# Altium schematic sheet 5) 64MB SDRAM.SchDoc
size 420 x 297 mm
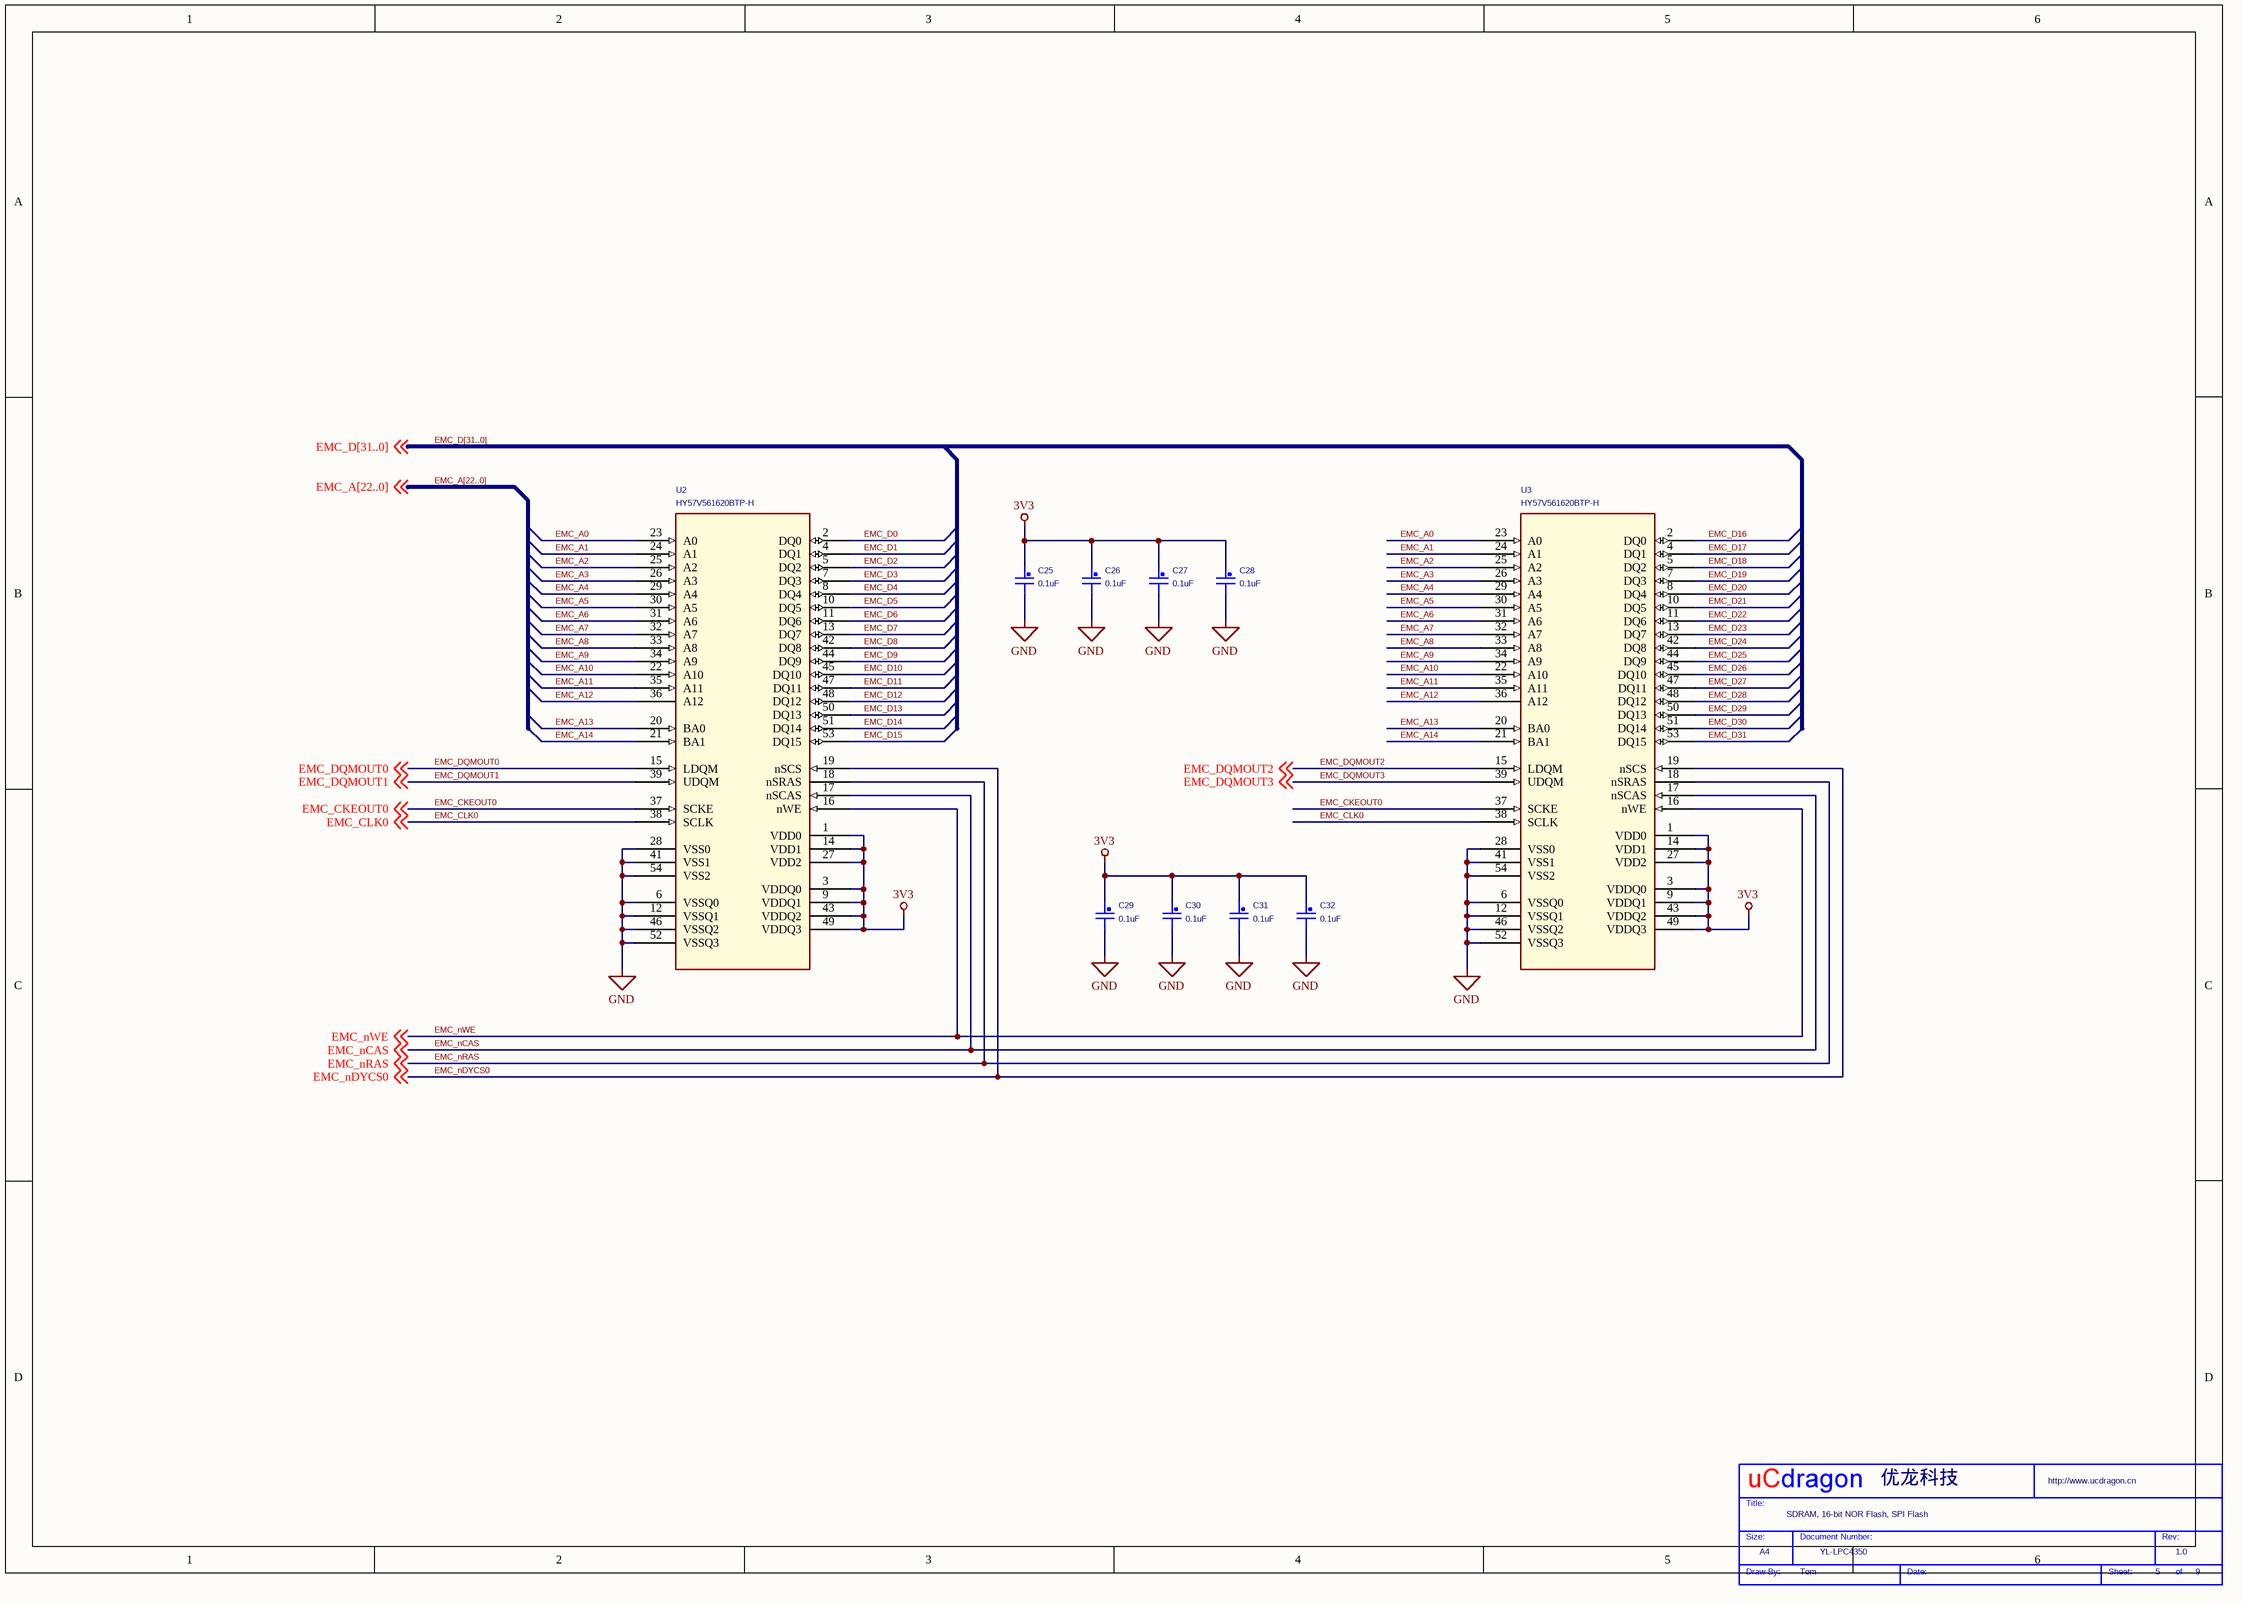
[diagram p0: 5) 64MB SDRAM.SchDoc]

## Parts
*  Company: 优龙科技  Drawing: Tom  Doc: YL-LPC4350  RevCode: 1.0  Title: SDRAM, 16-bit NOR Flash, SPI Flash  Page Size: A4  Page Number: 5  Page Count: 9  (hidden comment: My Title 0)  (graphical)
C25  0.1uF  [CAP0805]
C26  0.1uF  [CAP0805]
C27  0.1uF  [CAP0805]
C28  0.1uF  [CAP0805]
C29  0.1uF  [CAP0805]
C30  0.1uF  [CAP0805]
C31  0.1uF  [CAP0805]
C32  0.1uF  [CAP0805]
U2  HY57V561620BTP-H  [K4S561632E-TSOP54]
U3  HY57V561620BTP-H  [K4S561632E-TSOP54]

## Nets
3V3: C25.1 C26.1 C27.1 C28.1 C29.1 C30.1 C31.1 C32.1 U2.1(VDD0) U2.3(VDDQ0) U2.9(VDDQ1) U2.14(VDD1) U2.27(VDD2) U2.43(VDDQ2) U2.49(VDDQ3) U3.1(VDD0) U3.3(VDDQ0) U3.9(VDDQ1) U3.14(VDD1) U3.27(VDD2) U3.43(VDDQ2) U3.49(VDDQ3)
GND: C25.2 C26.2 C27.2 C28.2 C29.2 C30.2 C31.2 C32.2 U2.6(VSSQ0) U2.12(VSSQ1) U2.28(VSS0) U2.41(VSS1) U2.46(VSSQ2) U2.52(VSSQ3) U2.54(VSS2) U3.6(VSSQ0) U3.12(VSSQ1) U3.28(VSS0) U3.41(VSS1) U3.46(VSSQ2) U3.52(VSSQ3) U3.54(VSS2)
EMC_A0: U2.23(A0) U3.23(A0)
EMC_A1: U2.24(A1) U3.24(A1)
EMC_A2: U2.25(A2) U3.25(A2)
EMC_A3: U2.26(A3) U3.26(A3)
EMC_A4: U2.29(A4) U3.29(A4)
EMC_A5: U2.30(A5) U3.30(A5)
EMC_A6: U2.31(A6) U3.31(A6)
EMC_A7: U2.32(A7) U3.32(A7)
EMC_A8: U2.33(A8) U3.33(A8)
EMC_A9: U2.34(A9) U3.34(A9)
EMC_A10: U2.22(A10) U3.22(A10)
EMC_A11: U2.35(A11) U3.35(A11)
EMC_A12: U2.36(A12) U3.36(A12)
EMC_A13: U2.20(BA0) U3.20(BA0)
EMC_A14: U2.21(BA1) U3.21(BA1)
EMC_CKEOUT0: U2.37(SCKE) U3.37(SCKE) ; off-sheet EMC_CKEOUT0
EMC_CLK0: U2.38(SCLK) U3.38(SCLK) ; off-sheet EMC_CLK0
EMC_D0: U2.2(DQ0)
EMC_D1: U2.4(DQ1)
EMC_D2: U2.5(DQ2)
EMC_D3: U2.7(DQ3)
EMC_D4: U2.8(DQ4)
EMC_D5: U2.10(DQ5)
EMC_D6: U2.11(DQ6)
EMC_D7: U2.13(DQ7)
EMC_D8: U2.42(DQ8)
EMC_D9: U2.44(DQ9)
EMC_D10: U2.45(DQ10)
EMC_D11: U2.47(DQ11)
EMC_D12: U2.48(DQ12)
EMC_D13: U2.50(DQ13)
EMC_D14: U2.51(DQ14)
EMC_D15: U2.53(DQ15)
EMC_D16: U3.2(DQ0)
EMC_D17: U3.4(DQ1)
EMC_D18: U3.5(DQ2)
EMC_D19: U3.7(DQ3)
EMC_D20: U3.8(DQ4)
EMC_D21: U3.10(DQ5)
EMC_D22: U3.11(DQ6)
EMC_D23: U3.13(DQ7)
EMC_D24: U3.42(DQ8)
EMC_D25: U3.44(DQ9)
EMC_D26: U3.45(DQ10)
EMC_D27: U3.47(DQ11)
EMC_D28: U3.48(DQ12)
EMC_D29: U3.50(DQ13)
EMC_D30: U3.51(DQ14)
EMC_D31: U3.53(DQ15)
EMC_DQMOUT0: U2.15(LDQM) ; off-sheet EMC_DQMOUT0
EMC_DQMOUT1: U2.39(UDQM) ; off-sheet EMC_DQMOUT1
EMC_DQMOUT2: U3.15(LDQM) ; off-sheet EMC_DQMOUT2
EMC_DQMOUT3: U3.39(UDQM) ; off-sheet EMC_DQMOUT3
EMC_nCAS: U2.17(nSCAS) U3.17(nSCAS) ; off-sheet EMC_nCAS
EMC_nDYCS0: U2.19(nSCS) U3.19(nSCS) ; off-sheet EMC_nDYCS0
EMC_nRAS: U2.18(nSRAS) U3.18(nSRAS) ; off-sheet EMC_nRAS
EMC_nWE: U2.16(nWE) U3.16(nWE) ; off-sheet EMC_nWE

## Buses and harness runs
bus EMC_A[22..0]
bus EMC_D[31..0]

## Notes on the sheet
- (in symbol My Title 0) Title:; Size:; Document Number:; Rev:; Draw By:; Date:; Sheet:; of

## Library data of the parts
C25-C32 = C_Generic: Toler.: 10%; P/N #1: C0603C104K4RAC; Voltage: 16V; Mfg #1: KEMET; Dielectric: X7R
U2 U3 = K4S561632C
* = My Title 0: WebSite: http://www.ucdragon.cn; Page Create Date: May 29, 2006